# Altium project SpotWelder_Logic.PrjPcb
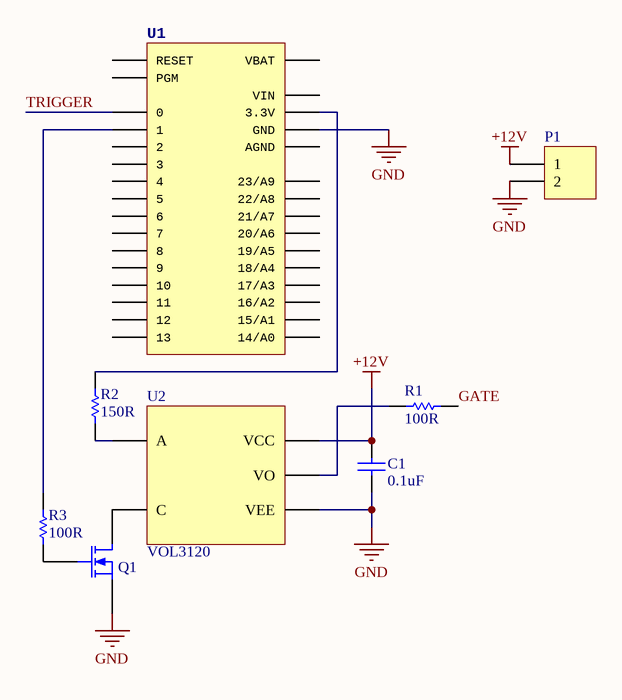
[diagram p0: Logic.SchDoc]
1 sheet, 8 parts. Net scope: global (net labels, ports and power ports of the same name join across sheets).
Board file: Logic.PcbDoc

## Sheet Logic.SchDoc
size A

### Parts
C1  0.1uF  [CAPC0603(1608)100_L]
P1  (no value)  [HDR1X2]
Q1  MOSFET-N  [SOT23-3]  (value not drawn)
R1  100R  [RESC0603(1608)_L]
R2  150R  [RESC0603(1608)_L]
R3  100R  [RESC0603(1608)_L]
U1  (no value)  [TEENSY_3.0_BASIC]
U2  VOL3120  [LSOP-5]

### Nets
+12V: C1.2 P1.1 U2.5(VCC)
GND: C1.1 P1.2 Q1.3(S) U1.GND_GND1(GND) U2.3(VEE)
GATE: R1.1
TRIGGER: U1.0
NetQ1_1: Q1.1(G) R3.1
NetQ1_2: Q1.2(D) U2.2(C)
NetR1_2: R1.2 U2.4(VO)
NetR2_1: R2.1 U2.1(A)
NetR2_2: R2.2 U1.3.3V_3.3V1(3.3V)
NetR3_2: R3.2 U1.1

Not connected (* = marked no-connect by the designer): U1 2 3 4 5 6 7 8 9 10 11 12 13 14/A0 15/A1 16/A2 17/A3 18/A4 19/A5 20/A6 21/A7 22/A8 23/A9 AGND PGM RESET VBAT VIN

### Library data of the parts
C1 = CMP-1035-02595-1: CAP 100nF 100V Â±10% 0603 (1608 Metric) Thickness 1mm SMD; Case-EIA: 0603; Case-Metric: 1608; Tolerance: Â±10%; Rated Voltage: 100 V; Value: 100nF; Technology: SMT; Max Thickness: 1 mm
P1 = Header 2: Header, 2-Pin; LatestRevisionDate: 17-Jul-2002; LatestRevisionNote: Re-released for DXP Platform.; Publisher: Altium Limited
Q1 = MOSFET-N: N-Channel MOSFET; Published: 8-Jun-2000; LatestRevisionDate: 17-Jul-2002; LatestRevisionNote: Re-released for DXP Platform.; PackageVersion: 1995/1996; PackageReference: E3; Publisher: Altium Limited; PackageDescription: TO, Flat Index; 3 In-Line, Axial Leads; Body Dia. 4.6mm; Lead Dia. 0.5 mm (max)
R1 R3 = CMP-1012-00050-1: 100R 0.1W 5% 0603 (1608 Metric)  SMD; Case-EIA: 0603; Value: 100.00 Ohm; Case-Metric: 1608; Tolerance: 5 %; Technology: SMT; Power: 0.1 W
R2 = CMP-1012-00054-1: 150R 0.1W 5% 0603 (1608 Metric)  SMD; Case-EIA: 0603; Value: 150.00 Ohm; Case-Metric: 1608; Power: 0.1 W; Tolerance: 5 %; Technology: SMT
U1 = TEENSY_3.0_BASIC: pin to pad: 3.3V 3.3V1>3.3V+3.3V1 GND GND1>GND+GND1